# Altium project Placa_registros.PrjPcb (part 2 of 2)

## Sheet LED´s_Teclado2.SchDoc
size A4
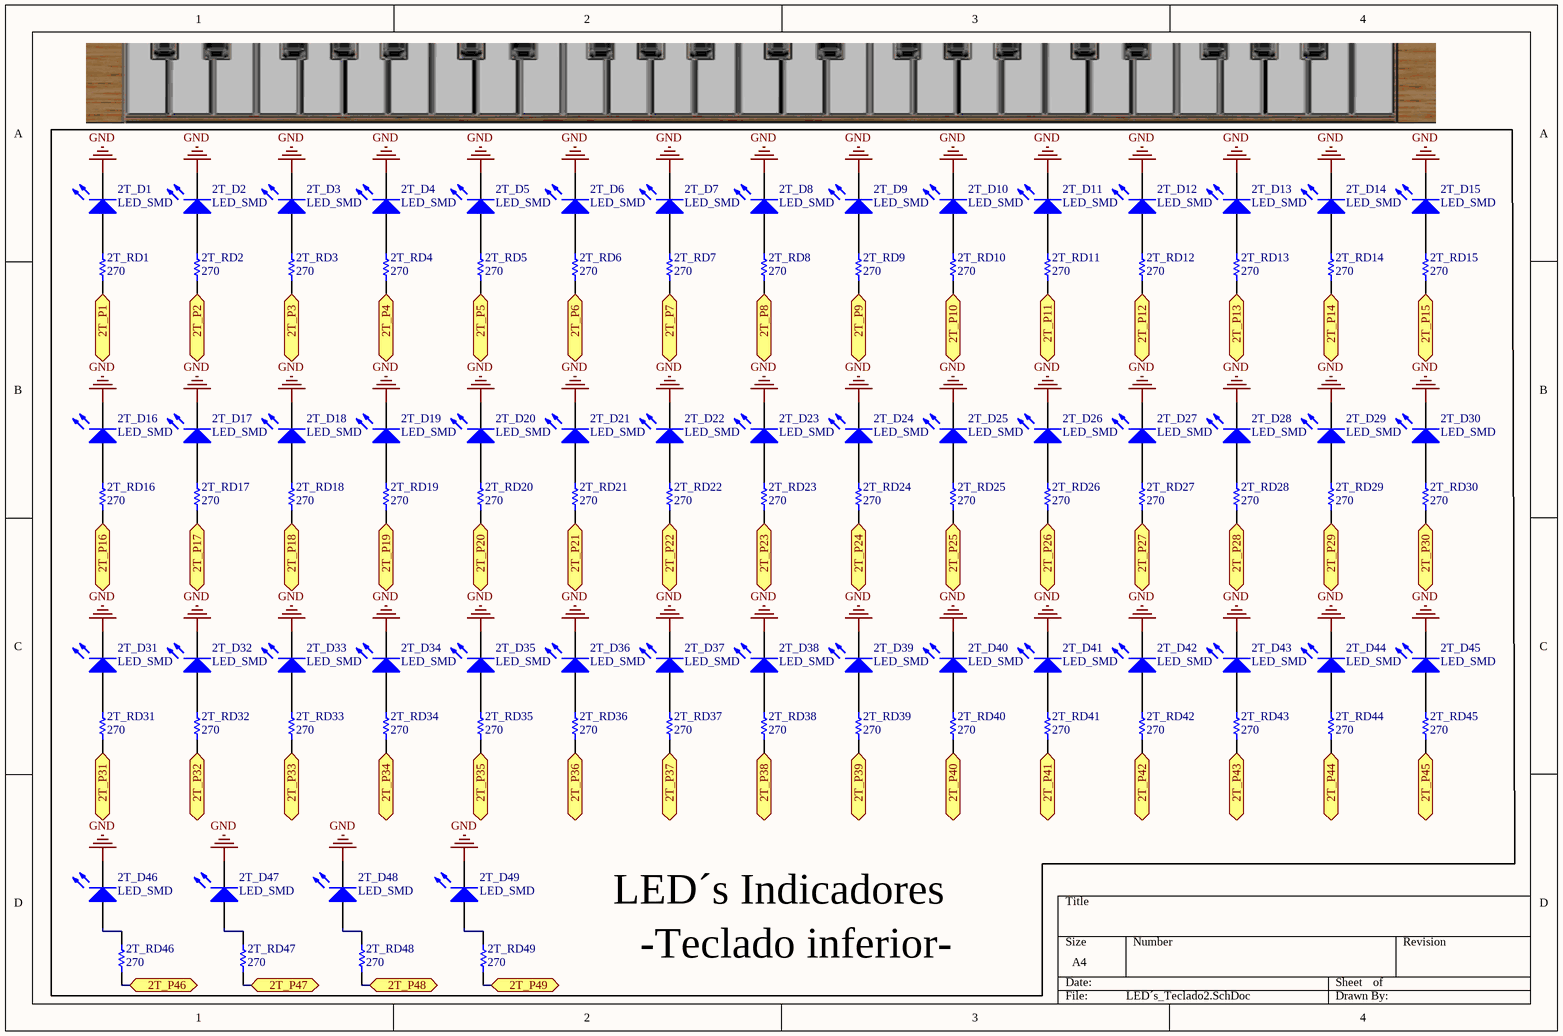
[diagram p7: LED´s_Teclado2.SchDoc]

### Parts
2T_D1  LED_SMD  [0805]
2T_D2  LED_SMD  [0805]
2T_D3  LED_SMD  [0805]
2T_D4  LED_SMD  [0805]
2T_D5  LED_SMD  [0805]
2T_D6  LED_SMD  [0805]
2T_D7  LED_SMD  [0805]
2T_D8  LED_SMD  [0805]
2T_D9  LED_SMD  [0805]
2T_D10  LED_SMD  [0805]
2T_D11  LED_SMD  [0805]
2T_D12  LED_SMD  [0805]
2T_D13  LED_SMD  [0805]
2T_D14  LED_SMD  [0805]
2T_D15  LED_SMD  [0805]
2T_D16  LED_SMD  [0805]
2T_D17  LED_SMD  [0805]
2T_D18  LED_SMD  [0805]
2T_D19  LED_SMD  [0805]
2T_D20  LED_SMD  [0805]
2T_D21  LED_SMD  [0805]
2T_D22  LED_SMD  [0805]
2T_D23  LED_SMD  [0805]
2T_D24  LED_SMD  [0805]
2T_D25  LED_SMD  [0805]
2T_D26  LED_SMD  [0805]
2T_D27  LED_SMD  [0805]
2T_D28  LED_SMD  [0805]
2T_D29  LED_SMD  [0805]
2T_D30  LED_SMD  [0805]
2T_D31  LED_SMD  [0805]
2T_D32  LED_SMD  [0805]
2T_D33  LED_SMD  [0805]
2T_D34  LED_SMD  [0805]
2T_D35  LED_SMD  [0805]
2T_D36  LED_SMD  [0805]
2T_D37  LED_SMD  [0805]
2T_D38  LED_SMD  [0805]
2T_D39  LED_SMD  [0805]
2T_D40  LED_SMD  [0805]
2T_D41  LED_SMD  [0805]
2T_D42  LED_SMD  [0805]
2T_D43  LED_SMD  [0805]
2T_D44  LED_SMD  [0805]
2T_D45  LED_SMD  [0805]
2T_D46  LED_SMD  [0805]
2T_D47  LED_SMD  [0805]
2T_D48  LED_SMD  [0805]
2T_D49  LED_SMD  [0805]
2T_RD1  value 270  [0805 Chip Res]  (hidden comment: Res Chip 0805)
2T_RD2  value 270  [0805 Chip Res]  (hidden comment: Res Chip 0805)
2T_RD3  value 270  [0805 Chip Res]  (hidden comment: Res Chip 0805)
2T_RD4  value 270  [0805 Chip Res]  (hidden comment: Res Chip 0805)
2T_RD5  value 270  [0805 Chip Res]  (hidden comment: Res Chip 0805)
2T_RD6  value 270  [0805 Chip Res]  (hidden comment: Res Chip 0805)
2T_RD7  value 270  [0805 Chip Res]  (hidden comment: Res Chip 0805)
2T_RD8  value 270  [0805 Chip Res]  (hidden comment: Res Chip 0805)
2T_RD9  value 270  [0805 Chip Res]  (hidden comment: Res Chip 0805)
2T_RD10  value 270  [0805 Chip Res]  (hidden comment: Res Chip 0805)
2T_RD11  value 270  [0805 Chip Res]  (hidden comment: Res Chip 0805)
2T_RD12  value 270  [0805 Chip Res]  (hidden comment: Res Chip 0805)
2T_RD13  value 270  [0805 Chip Res]  (hidden comment: Res Chip 0805)
2T_RD14  value 270  [0805 Chip Res]  (hidden comment: Res Chip 0805)
2T_RD15  value 270  [0805 Chip Res]  (hidden comment: Res Chip 0805)
2T_RD16  value 270  [0805 Chip Res]  (hidden comment: Res Chip 0805)
2T_RD17  value 270  [0805 Chip Res]  (hidden comment: Res Chip 0805)
2T_RD18  value 270  [0805 Chip Res]  (hidden comment: Res Chip 0805)
2T_RD19  value 270  [0805 Chip Res]  (hidden comment: Res Chip 0805)
2T_RD20  value 270  [0805 Chip Res]  (hidden comment: Res Chip 0805)
2T_RD21  value 270  [0805 Chip Res]  (hidden comment: Res Chip 0805)
2T_RD22  value 270  [0805 Chip Res]  (hidden comment: Res Chip 0805)
2T_RD23  value 270  [0805 Chip Res]  (hidden comment: Res Chip 0805)
2T_RD24  value 270  [0805 Chip Res]  (hidden comment: Res Chip 0805)
2T_RD25  value 270  [0805 Chip Res]  (hidden comment: Res Chip 0805)
2T_RD26  value 270  [0805 Chip Res]  (hidden comment: Res Chip 0805)
2T_RD27  value 270  [0805 Chip Res]  (hidden comment: Res Chip 0805)
2T_RD28  value 270  [0805 Chip Res]  (hidden comment: Res Chip 0805)
2T_RD29  value 270  [0805 Chip Res]  (hidden comment: Res Chip 0805)
2T_RD30  value 270  [0805 Chip Res]  (hidden comment: Res Chip 0805)
2T_RD31  value 270  [0805 Chip Res]  (hidden comment: Res Chip 0805)
2T_RD32  value 270  [0805 Chip Res]  (hidden comment: Res Chip 0805)
2T_RD33  value 270  [0805 Chip Res]  (hidden comment: Res Chip 0805)
2T_RD34  value 270  [0805 Chip Res]  (hidden comment: Res Chip 0805)
2T_RD35  value 270  [0805 Chip Res]  (hidden comment: Res Chip 0805)
2T_RD36  value 270  [0805 Chip Res]  (hidden comment: Res Chip 0805)
2T_RD37  value 270  [0805 Chip Res]  (hidden comment: Res Chip 0805)
2T_RD38  value 270  [0805 Chip Res]  (hidden comment: Res Chip 0805)
2T_RD39  value 270  [0805 Chip Res]  (hidden comment: Res Chip 0805)
2T_RD40  value 270  [0805 Chip Res]  (hidden comment: Res Chip 0805)
2T_RD41  value 270  [0805 Chip Res]  (hidden comment: Res Chip 0805)
2T_RD42  value 270  [0805 Chip Res]  (hidden comment: Res Chip 0805)
2T_RD43  value 270  [0805 Chip Res]  (hidden comment: Res Chip 0805)
2T_RD44  value 270  [0805 Chip Res]  (hidden comment: Res Chip 0805)
2T_RD45  value 270  [0805 Chip Res]  (hidden comment: Res Chip 0805)
2T_RD46  value 270  [0805 Chip Res]  (hidden comment: Res Chip 0805)
2T_RD47  value 270  [0805 Chip Res]  (hidden comment: Res Chip 0805)
2T_RD48  value 270  [0805 Chip Res]  (hidden comment: Res Chip 0805)
2T_RD49  value 270  [0805 Chip Res]  (hidden comment: Res Chip 0805)

### Ports
2T_P1, 2T_P2, 2T_P3, 2T_P4, 2T_P5, 2T_P6, 2T_P7, 2T_P8, 2T_P9, 2T_P10, 2T_P11, 2T_P12, 2T_P13, 2T_P14, 2T_P15, 2T_P16, 2T_P17, 2T_P18, 2T_P19, 2T_P20, 2T_P21, 2T_P22, 2T_P23, 2T_P24, 2T_P25, 2T_P26, 2T_P27, 2T_P28, 2T_P29, 2T_P30, 2T_P31, 2T_P32, 2T_P33, 2T_P34, 2T_P35, 2T_P36, 2T_P37, 2T_P38, 2T_P39, 2T_P40, 2T_P41, 2T_P42, 2T_P43, 2T_P44, 2T_P45, 2T_P46, 2T_P47, 2T_P48, 2T_P49

### Nets
GND: 2T_D1.2(K) 2T_D2.2(K) 2T_D3.2(K) 2T_D4.2(K) 2T_D5.2(K) 2T_D6.2(K) 2T_D7.2(K) 2T_D8.2(K) 2T_D9.2(K) 2T_D10.2(K) 2T_D11.2(K) 2T_D12.2(K) 2T_D13.2(K) 2T_D14.2(K) 2T_D15.2(K) 2T_D16.2(K) 2T_D17.2(K) 2T_D18.2(K) 2T_D19.2(K) 2T_D20.2(K) 2T_D21.2(K) 2T_D22.2(K) 2T_D23.2(K) 2T_D24.2(K) 2T_D25.2(K) 2T_D26.2(K) 2T_D27.2(K) 2T_D28.2(K) 2T_D29.2(K) 2T_D30.2(K) 2T_D31.2(K) 2T_D32.2(K) 2T_D33.2(K) 2T_D34.2(K) 2T_D35.2(K) 2T_D36.2(K) 2T_D37.2(K) 2T_D38.2(K) 2T_D39.2(K) 2T_D40.2(K) 2T_D41.2(K) 2T_D42.2(K) 2T_D43.2(K) 2T_D44.2(K) 2T_D45.2(K) 2T_D46.2(K) 2T_D47.2(K) 2T_D48.2(K) 2T_D49.2(K)
Net2T_A1_10: 2T_RD7.1 ; port 2T_P7
Net2T_A1_11: 2T_RD6.1 ; port 2T_P6
Net2T_A1_12: 2T_RD5.1 ; port 2T_P5
Net2T_A1_13: 2T_RD4.1 ; port 2T_P4
Net2T_A1_14: 2T_RD3.1 ; port 2T_P3
Net2T_A1_15: 2T_RD2.1 ; port 2T_P2
Net2T_A1_16: 2T_RD1.1 ; port 2T_P1
Net2T_A2_10: 2T_RD14.1 ; port 2T_P14
Net2T_A2_11: 2T_RD13.1 ; port 2T_P13
Net2T_A2_12: 2T_RD12.1 ; port 2T_P12
Net2T_A2_13: 2T_RD11.1 ; port 2T_P11
Net2T_A2_14: 2T_RD10.1 ; port 2T_P10
Net2T_A2_15: 2T_RD9.1 ; port 2T_P9
Net2T_A2_16: 2T_RD8.1 ; port 2T_P8
Net2T_A3_10: 2T_RD21.1 ; port 2T_P21
Net2T_A3_11: 2T_RD20.1 ; port 2T_P20
Net2T_A3_12: 2T_RD19.1 ; port 2T_P19
Net2T_A3_13: 2T_RD18.1 ; port 2T_P18
Net2T_A3_14: 2T_RD17.1 ; port 2T_P17
Net2T_A3_15: 2T_RD16.1 ; port 2T_P16
Net2T_A3_16: 2T_RD15.1 ; port 2T_P15
Net2T_A4_10: 2T_RD28.1 ; port 2T_P28
Net2T_A4_11: 2T_RD27.1 ; port 2T_P27
Net2T_A4_12: 2T_RD26.1 ; port 2T_P26
Net2T_A4_13: 2T_RD25.1 ; port 2T_P25
Net2T_A4_14: 2T_RD24.1 ; port 2T_P24
Net2T_A4_15: 2T_RD23.1 ; port 2T_P23
Net2T_A4_16: 2T_RD22.1 ; port 2T_P22
Net2T_A5_10: 2T_RD35.1 ; port 2T_P35
Net2T_A5_11: 2T_RD34.1 ; port 2T_P34
Net2T_A5_12: 2T_RD33.1 ; port 2T_P33
Net2T_A5_13: 2T_RD32.1 ; port 2T_P32
Net2T_A5_14: 2T_RD31.1 ; port 2T_P31
Net2T_A5_15: 2T_RD30.1 ; port 2T_P30
Net2T_A5_16: 2T_RD29.1 ; port 2T_P29
Net2T_A6_10: 2T_RD42.1 ; port 2T_P42
Net2T_A6_11: 2T_RD41.1 ; port 2T_P41
Net2T_A6_12: 2T_RD40.1 ; port 2T_P40
Net2T_A6_13: 2T_RD39.1 ; port 2T_P39
Net2T_A6_14: 2T_RD38.1 ; port 2T_P38
Net2T_A6_15: 2T_RD37.1 ; port 2T_P37
Net2T_A6_16: 2T_RD36.1 ; port 2T_P36
Net2T_A7_10: 2T_RD49.1 ; port 2T_P49
Net2T_A7_11: 2T_RD48.1 ; port 2T_P48
Net2T_A7_12: 2T_RD47.1 ; port 2T_P47
Net2T_A7_13: 2T_RD46.1 ; port 2T_P46
Net2T_A7_14: 2T_RD45.1 ; port 2T_P45
Net2T_A7_15: 2T_RD44.1 ; port 2T_P44
Net2T_A7_16: 2T_RD43.1 ; port 2T_P43
Net2T_D1_1: 2T_D1.1(A) 2T_RD1.2
Net2T_D2_1: 2T_D2.1(A) 2T_RD2.2
Net2T_D3_1: 2T_D3.1(A) 2T_RD3.2
Net2T_D4_1: 2T_D4.1(A) 2T_RD4.2
Net2T_D5_1: 2T_D5.1(A) 2T_RD5.2
Net2T_D6_1: 2T_D6.1(A) 2T_RD6.2
Net2T_D7_1: 2T_D7.1(A) 2T_RD7.2
Net2T_D8_1: 2T_D8.1(A) 2T_RD8.2
Net2T_D9_1: 2T_D9.1(A) 2T_RD9.2
Net2T_D10_1: 2T_D10.1(A) 2T_RD10.2
Net2T_D11_1: 2T_D11.1(A) 2T_RD11.2
Net2T_D12_1: 2T_D12.1(A) 2T_RD12.2
Net2T_D13_1: 2T_D13.1(A) 2T_RD13.2
Net2T_D14_1: 2T_D14.1(A) 2T_RD14.2
Net2T_D15_1: 2T_D15.1(A) 2T_RD15.2
Net2T_D16_1: 2T_D16.1(A) 2T_RD16.2
Net2T_D17_1: 2T_D17.1(A) 2T_RD17.2
Net2T_D18_1: 2T_D18.1(A) 2T_RD18.2
Net2T_D19_1: 2T_D19.1(A) 2T_RD19.2
Net2T_D20_1: 2T_D20.1(A) 2T_RD20.2
Net2T_D21_1: 2T_D21.1(A) 2T_RD21.2
Net2T_D22_1: 2T_D22.1(A) 2T_RD22.2
Net2T_D23_1: 2T_D23.1(A) 2T_RD23.2
Net2T_D24_1: 2T_D24.1(A) 2T_RD24.2
Net2T_D25_1: 2T_D25.1(A) 2T_RD25.2
Net2T_D26_1: 2T_D26.1(A) 2T_RD26.2
Net2T_D27_1: 2T_D27.1(A) 2T_RD27.2
Net2T_D28_1: 2T_D28.1(A) 2T_RD28.2
Net2T_D29_1: 2T_D29.1(A) 2T_RD29.2
Net2T_D30_1: 2T_D30.1(A) 2T_RD30.2
Net2T_D31_1: 2T_D31.1(A) 2T_RD31.2
Net2T_D32_1: 2T_D32.1(A) 2T_RD32.2
Net2T_D33_1: 2T_D33.1(A) 2T_RD33.2
Net2T_D34_1: 2T_D34.1(A) 2T_RD34.2
Net2T_D35_1: 2T_D35.1(A) 2T_RD35.2
Net2T_D36_1: 2T_D36.1(A) 2T_RD36.2
Net2T_D37_1: 2T_D37.1(A) 2T_RD37.2
Net2T_D38_1: 2T_D38.1(A) 2T_RD38.2
Net2T_D39_1: 2T_D39.1(A) 2T_RD39.2
Net2T_D40_1: 2T_D40.1(A) 2T_RD40.2
Net2T_D41_1: 2T_D41.1(A) 2T_RD41.2
Net2T_D42_1: 2T_D42.1(A) 2T_RD42.2
Net2T_D43_1: 2T_D43.1(A) 2T_RD43.2
Net2T_D44_1: 2T_D44.1(A) 2T_RD44.2
Net2T_D45_1: 2T_D45.1(A) 2T_RD45.2
Net2T_D46_1: 2T_D46.1(A) 2T_RD46.2
Net2T_D47_1: 2T_D47.1(A) 2T_RD47.2
Net2T_D48_1: 2T_D48.1(A) 2T_RD48.2
Net2T_D49_1: 2T_D49.1(A) 2T_RD49.2

### Notes on the sheet
- LED´s Indicadores
- -Teclado inferior-

### Library data of the parts
2T_D1-2T_D49 = LED_SMD: LED SMD; Published: 8-Jun-2000; LatestRevisionDate: 08-Jul-2005; LatestRevisionNote: Mech Layer 1 removed.; PackageReference: LED-0; Publisher: Altium Limited
2T_RD1-2T_RD49 = Resistencia: Published: 8-Jun-2000; LatestRevisionDate: 17-Jul-2002; LatestRevisionNote: Re-released for DXP Platform.; PackageReference: AXIAL-0.3; Publisher: Altium Limited; PackageDescription: Axial Device, Thru-Hole; 2 Leads; 0.3 in Pin Spacing

## Sheet LED´s_Valvulas.SchDoc
size A4
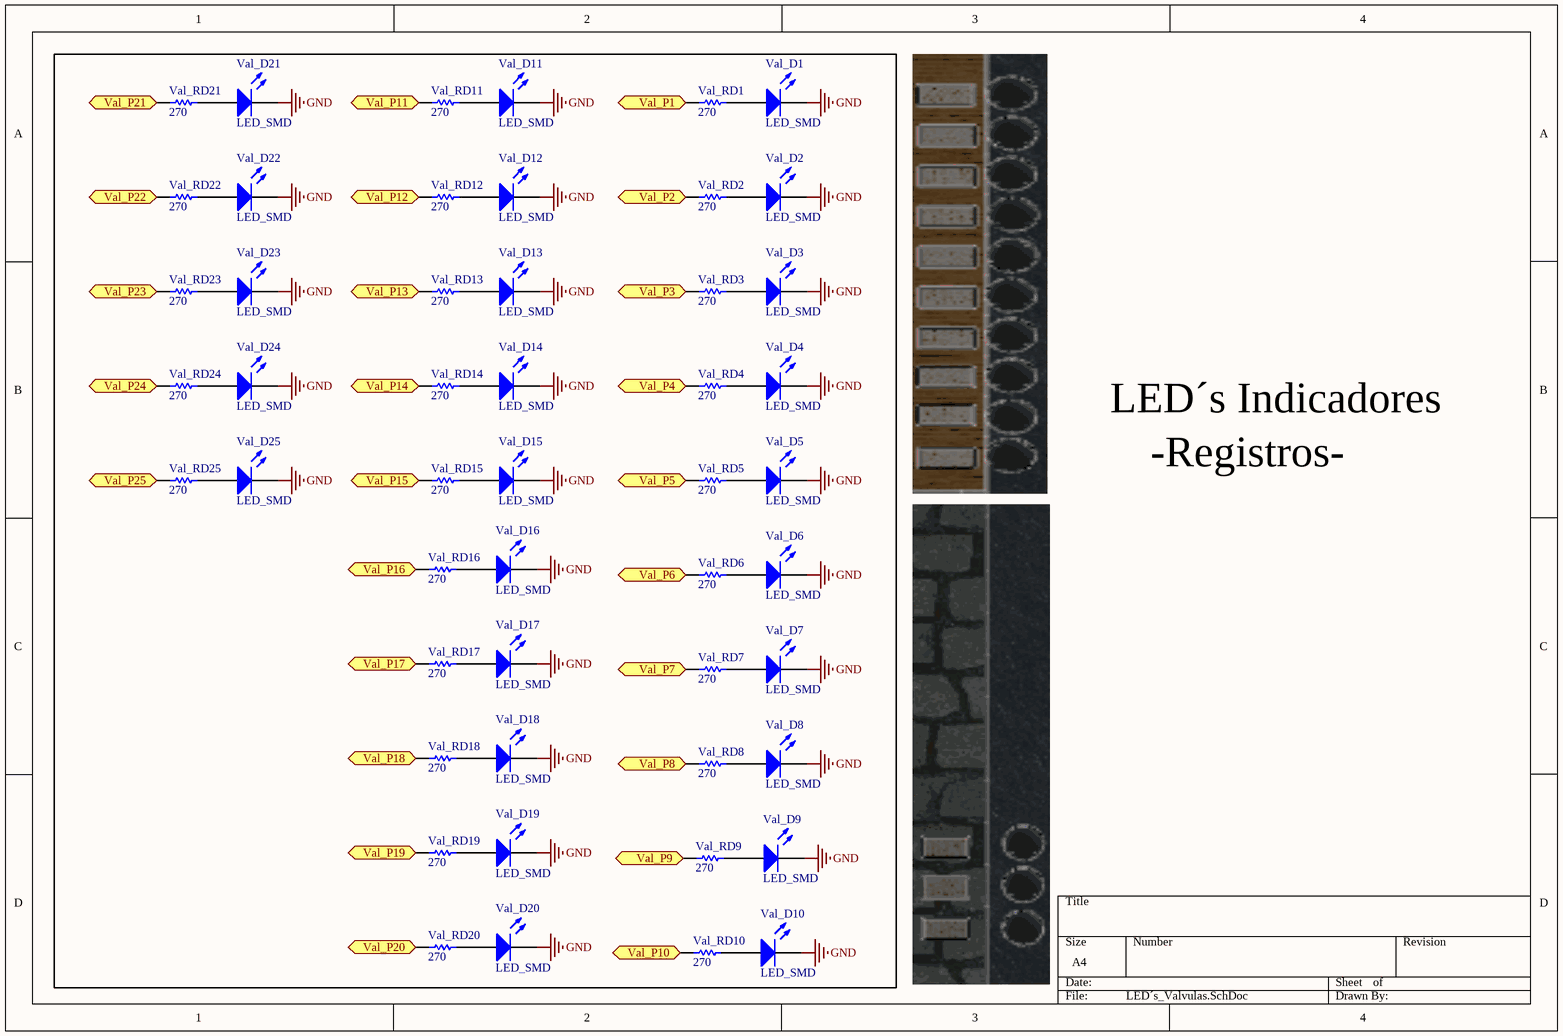
[diagram p8: LED´s_Valvulas.SchDoc]

### Parts
Val_D1  LED_SMD  [0805]
Val_D2  LED_SMD  [0805]
Val_D3  LED_SMD  [0805]
Val_D4  LED_SMD  [0805]
Val_D5  LED_SMD  [0805]
Val_D6  LED_SMD  [0805]
Val_D7  LED_SMD  [0805]
Val_D8  LED_SMD  [0805]
Val_D9  LED_SMD  [0805]
Val_D10  LED_SMD  [0805]
Val_D11  LED_SMD  [0805]
Val_D12  LED_SMD  [0805]
Val_D13  LED_SMD  [0805]
Val_D14  LED_SMD  [0805]
Val_D15  LED_SMD  [0805]
Val_D16  LED_SMD  [0805]
Val_D17  LED_SMD  [0805]
Val_D18  LED_SMD  [0805]
Val_D19  LED_SMD  [0805]
Val_D20  LED_SMD  [0805]
Val_D21  LED_SMD  [0805]
Val_D22  LED_SMD  [0805]
Val_D23  LED_SMD  [0805]
Val_D24  LED_SMD  [0805]
Val_D25  LED_SMD  [0805]
Val_RD1  value 270  [0805 Chip Res]  (hidden comment: Res Chip 0805)
Val_RD2  value 270  [0805 Chip Res]  (hidden comment: Res Chip 0805)
Val_RD3  value 270  [0805 Chip Res]  (hidden comment: Res Chip 0805)
Val_RD4  value 270  [0805 Chip Res]  (hidden comment: Res Chip 0805)
Val_RD5  value 270  [0805 Chip Res]  (hidden comment: Res Chip 0805)
Val_RD6  value 270  [0805 Chip Res]  (hidden comment: Res Chip 0805)
Val_RD7  value 270  [0805 Chip Res]  (hidden comment: Res Chip 0805)
Val_RD8  value 270  [0805 Chip Res]  (hidden comment: Res Chip 0805)
Val_RD9  value 270  [0805 Chip Res]  (hidden comment: Res Chip 0805)
Val_RD10  value 270  [0805 Chip Res]  (hidden comment: Res Chip 0805)
Val_RD11  value 270  [0805 Chip Res]  (hidden comment: Res Chip 0805)
Val_RD12  value 270  [0805 Chip Res]  (hidden comment: Res Chip 0805)
Val_RD13  value 270  [0805 Chip Res]  (hidden comment: Res Chip 0805)
Val_RD14  value 270  [0805 Chip Res]  (hidden comment: Res Chip 0805)
Val_RD15  value 270  [0805 Chip Res]  (hidden comment: Res Chip 0805)
Val_RD16  value 270  [0805 Chip Res]  (hidden comment: Res Chip 0805)
Val_RD17  value 270  [0805 Chip Res]  (hidden comment: Res Chip 0805)
Val_RD18  value 270  [0805 Chip Res]  (hidden comment: Res Chip 0805)
Val_RD19  value 270  [0805 Chip Res]  (hidden comment: Res Chip 0805)
Val_RD20  value 270  [0805 Chip Res]  (hidden comment: Res Chip 0805)
Val_RD21  value 270  [0805 Chip Res]  (hidden comment: Res Chip 0805)
Val_RD22  value 270  [0805 Chip Res]  (hidden comment: Res Chip 0805)
Val_RD23  value 270  [0805 Chip Res]  (hidden comment: Res Chip 0805)
Val_RD24  value 270  [0805 Chip Res]  (hidden comment: Res Chip 0805)
Val_RD25  value 270  [0805 Chip Res]  (hidden comment: Res Chip 0805)

### Ports
Val_P1, Val_P2, Val_P3, Val_P4, Val_P5, Val_P6, Val_P7, Val_P8, Val_P9, Val_P10, Val_P11, Val_P12, Val_P13, Val_P14, Val_P15, Val_P16, Val_P17, Val_P18, Val_P19, Val_P20, Val_P21, Val_P22, Val_P23, Val_P24, Val_P25

### Nets
GND: Val_D1.2(K) Val_D2.2(K) Val_D3.2(K) Val_D4.2(K) Val_D5.2(K) Val_D6.2(K) Val_D7.2(K) Val_D8.2(K) Val_D9.2(K) Val_D10.2(K) Val_D11.2(K) Val_D12.2(K) Val_D13.2(K) Val_D14.2(K) Val_D15.2(K) Val_D16.2(K) Val_D17.2(K) Val_D18.2(K) Val_D19.2(K) Val_D20.2(K) Val_D21.2(K) Val_D22.2(K) Val_D23.2(K) Val_D24.2(K) Val_D25.2(K)
NetPines_Valvulas_1: Val_RD1.1 ; port Val_P1
NetPines_Valvulas_2: Val_RD14.1 ; port Val_P14
NetPines_Valvulas_3: Val_RD2.1 ; port Val_P2
NetPines_Valvulas_4: Val_RD15.1 ; port Val_P15
NetPines_Valvulas_5: Val_RD3.1 ; port Val_P3
NetPines_Valvulas_6: Val_RD16.1 ; port Val_P16
NetPines_Valvulas_7: Val_RD4.1 ; port Val_P4
NetPines_Valvulas_8: Val_RD17.1 ; port Val_P17
NetPines_Valvulas_9: Val_RD5.1 ; port Val_P5
NetPines_Valvulas_10: Val_RD18.1 ; port Val_P18
NetPines_Valvulas_11: Val_RD6.1 ; port Val_P6
NetPines_Valvulas_12: Val_RD19.1 ; port Val_P19
NetPines_Valvulas_13: Val_RD7.1 ; port Val_P7
NetPines_Valvulas_14: Val_RD20.1 ; port Val_P20
NetPines_Valvulas_15: Val_RD8.1 ; port Val_P8
NetPines_Valvulas_16: Val_RD21.1 ; port Val_P21
NetPines_Valvulas_17: Val_RD9.1 ; port Val_P9
NetPines_Valvulas_18: Val_RD22.1 ; port Val_P22
NetPines_Valvulas_19: Val_RD10.1 ; port Val_P10
NetPines_Valvulas_20: Val_RD23.1 ; port Val_P23
NetPines_Valvulas_21: Val_RD11.1 ; port Val_P11
NetPines_Valvulas_22: Val_RD24.1 ; port Val_P24
NetPines_Valvulas_23: Val_RD12.1 ; port Val_P12
NetPines_Valvulas_24: Val_RD25.1 ; port Val_P25
NetPines_Valvulas_25: Val_RD13.1 ; port Val_P13
NetVal_D1_1: Val_D1.1(A) Val_RD1.2
NetVal_D2_1: Val_D2.1(A) Val_RD2.2
NetVal_D3_1: Val_D3.1(A) Val_RD3.2
NetVal_D4_1: Val_D4.1(A) Val_RD4.2
NetVal_D5_1: Val_D5.1(A) Val_RD5.2
NetVal_D6_1: Val_D6.1(A) Val_RD6.2
NetVal_D7_1: Val_D7.1(A) Val_RD7.2
NetVal_D8_1: Val_D8.1(A) Val_RD8.2
NetVal_D9_1: Val_D9.1(A) Val_RD9.2
NetVal_D10_1: Val_D10.1(A) Val_RD10.2
NetVal_D11_1: Val_D11.1(A) Val_RD11.2
NetVal_D12_1: Val_D12.1(A) Val_RD12.2
NetVal_D13_1: Val_D13.1(A) Val_RD13.2
NetVal_D14_1: Val_D14.1(A) Val_RD14.2
NetVal_D15_1: Val_D15.1(A) Val_RD15.2
NetVal_D16_1: Val_D16.1(A) Val_RD16.2
NetVal_D17_1: Val_D17.1(A) Val_RD17.2
NetVal_D18_1: Val_D18.1(A) Val_RD18.2
NetVal_D19_1: Val_D19.1(A) Val_RD19.2
NetVal_D20_1: Val_D20.1(A) Val_RD20.2
NetVal_D21_1: Val_D21.1(A) Val_RD21.2
NetVal_D22_1: Val_D22.1(A) Val_RD22.2
NetVal_D23_1: Val_D23.1(A) Val_RD23.2
NetVal_D24_1: Val_D24.1(A) Val_RD24.2
NetVal_D25_1: Val_D25.1(A) Val_RD25.2

### Notes on the sheet
- LED´s Indicadores
- -Registros-

### Library data of the parts
Val_D1-Val_D25 = LED_SMD: LED SMD; Published: 8-Jun-2000; LatestRevisionDate: 08-Jul-2005; LatestRevisionNote: Mech Layer 1 removed.; PackageReference: LED-0; Publisher: Altium Limited
Val_RD1-Val_RD25 = Resistencia: Published: 8-Jun-2000; LatestRevisionDate: 17-Jul-2002; LatestRevisionNote: Re-released for DXP Platform.; PackageReference: AXIAL-0.3; Publisher: Altium Limited; PackageDescription: Axial Device, Thru-Hole; 2 Leads; 0.3 in Pin Spacing

## Sheet LED´s_Pedal.SchDoc
size A4
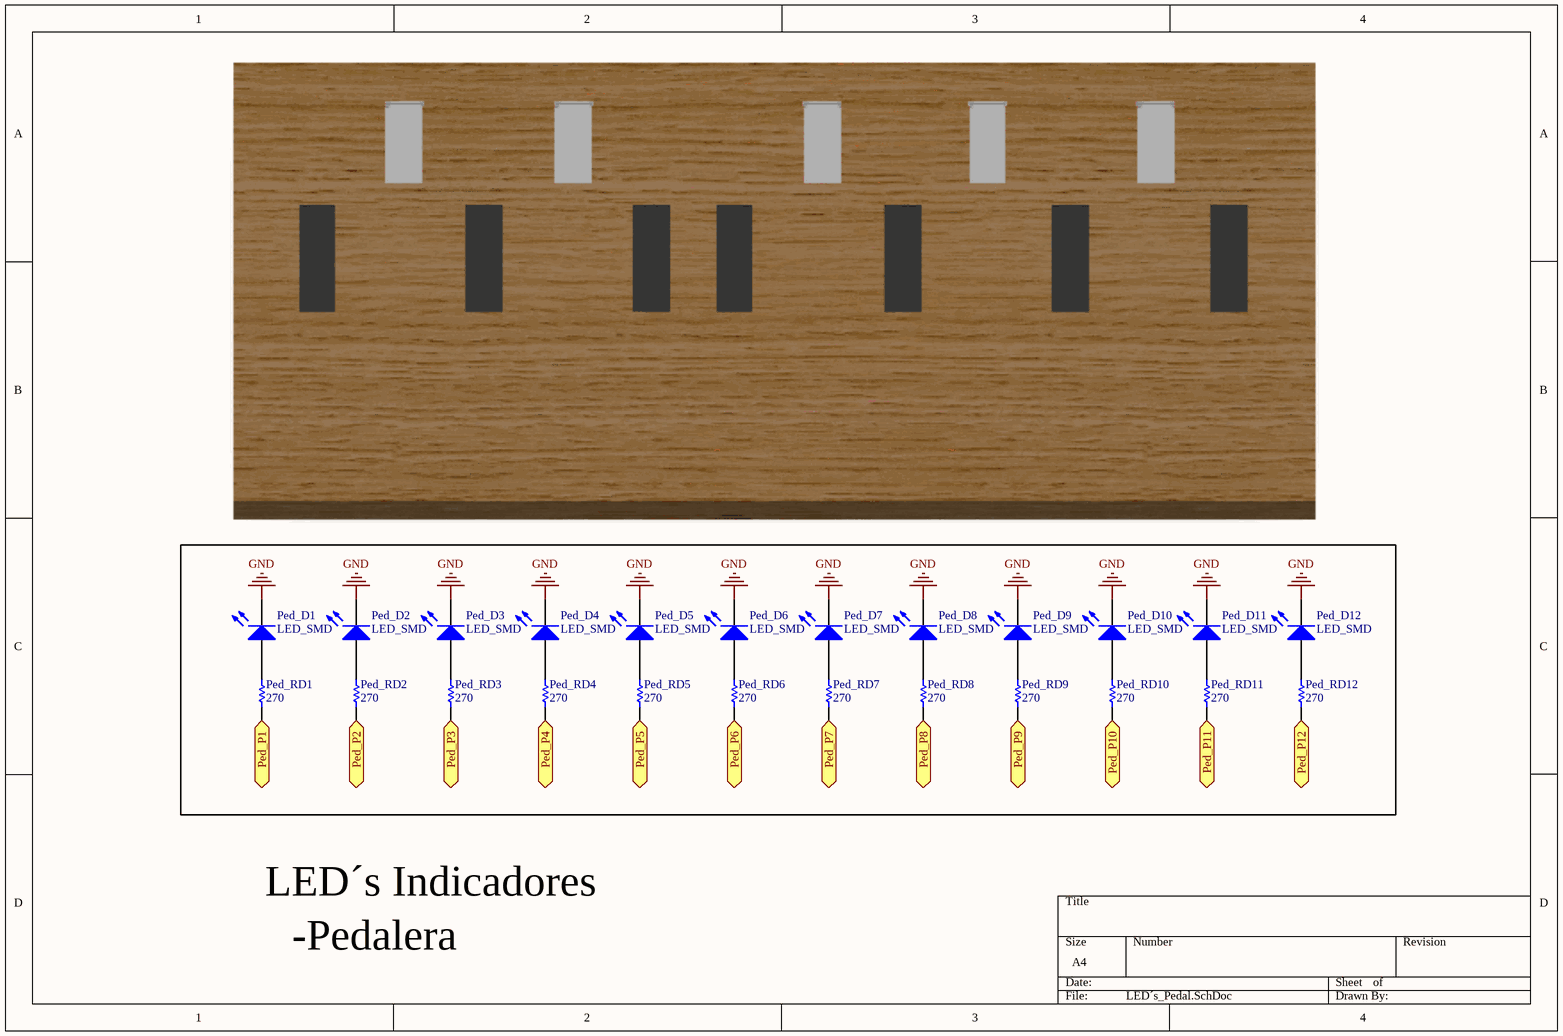
[diagram p9: LED´s_Pedal.SchDoc]

### Parts
Ped_D1  LED_SMD  [0805]
Ped_D2  LED_SMD  [0805]
Ped_D3  LED_SMD  [0805]
Ped_D4  LED_SMD  [0805]
Ped_D5  LED_SMD  [0805]
Ped_D6  LED_SMD  [0805]
Ped_D7  LED_SMD  [0805]
Ped_D8  LED_SMD  [0805]
Ped_D9  LED_SMD  [0805]
Ped_D10  LED_SMD  [0805]
Ped_D11  LED_SMD  [0805]
Ped_D12  LED_SMD  [0805]
Ped_RD1  value 270  [0805 Chip Res]  (hidden comment: Res Chip 0805)
Ped_RD2  value 270  [0805 Chip Res]  (hidden comment: Res Chip 0805)
Ped_RD3  value 270  [0805 Chip Res]  (hidden comment: Res Chip 0805)
Ped_RD4  value 270  [0805 Chip Res]  (hidden comment: Res Chip 0805)
Ped_RD5  value 270  [0805 Chip Res]  (hidden comment: Res Chip 0805)
Ped_RD6  value 270  [0805 Chip Res]  (hidden comment: Res Chip 0805)
Ped_RD7  value 270  [0805 Chip Res]  (hidden comment: Res Chip 0805)
Ped_RD8  value 270  [0805 Chip Res]  (hidden comment: Res Chip 0805)
Ped_RD9  value 270  [0805 Chip Res]  (hidden comment: Res Chip 0805)
Ped_RD10  value 270  [0805 Chip Res]  (hidden comment: Res Chip 0805)
Ped_RD11  value 270  [0805 Chip Res]  (hidden comment: Res Chip 0805)
Ped_RD12  value 270  [0805 Chip Res]  (hidden comment: Res Chip 0805)

### Ports
Ped_P1, Ped_P2, Ped_P3, Ped_P4, Ped_P5, Ped_P6, Ped_P7, Ped_P8, Ped_P9, Ped_P10, Ped_P11, Ped_P12

### Nets
GND: Ped_D1.2(K) Ped_D2.2(K) Ped_D3.2(K) Ped_D4.2(K) Ped_D5.2(K) Ped_D6.2(K) Ped_D7.2(K) Ped_D8.2(K) Ped_D9.2(K) Ped_D10.2(K) Ped_D11.2(K) Ped_D12.2(K)
NetPed_A1_10: Ped_RD7.1 ; port Ped_P7
NetPed_A1_11: Ped_RD6.1 ; port Ped_P6
NetPed_A1_12: Ped_RD5.1 ; port Ped_P5
NetPed_A1_13: Ped_RD4.1 ; port Ped_P4
NetPed_A1_14: Ped_RD3.1 ; port Ped_P3
NetPed_A1_15: Ped_RD2.1 ; port Ped_P2
NetPed_A1_16: Ped_RD1.1 ; port Ped_P1
NetPed_A2_12: Ped_RD12.1 ; port Ped_P12
NetPed_A2_13: Ped_RD11.1 ; port Ped_P11
NetPed_A2_14: Ped_RD10.1 ; port Ped_P10
NetPed_A2_15: Ped_RD9.1 ; port Ped_P9
NetPed_A2_16: Ped_RD8.1 ; port Ped_P8
NetPed_D1_1: Ped_D1.1(A) Ped_RD1.2
NetPed_D2_1: Ped_D2.1(A) Ped_RD2.2
NetPed_D3_1: Ped_D3.1(A) Ped_RD3.2
NetPed_D4_1: Ped_D4.1(A) Ped_RD4.2
NetPed_D5_1: Ped_D5.1(A) Ped_RD5.2
NetPed_D6_1: Ped_D6.1(A) Ped_RD6.2
NetPed_D7_1: Ped_D7.1(A) Ped_RD7.2
NetPed_D8_1: Ped_D8.1(A) Ped_RD8.2
NetPed_D9_1: Ped_D9.1(A) Ped_RD9.2
NetPed_D10_1: Ped_D10.1(A) Ped_RD10.2
NetPed_D11_1: Ped_D11.1(A) Ped_RD11.2
NetPed_D12_1: Ped_D12.1(A) Ped_RD12.2

### Notes on the sheet
- LED´s Indicadores
- -Pedalera

### Library data of the parts
Ped_D1-Ped_D12 = LED_SMD: LED SMD; Published: 8-Jun-2000; LatestRevisionDate: 08-Jul-2005; LatestRevisionNote: Mech Layer 1 removed.; PackageReference: LED-0; Publisher: Altium Limited
Ped_RD1-Ped_RD12 = Resistencia: Published: 8-Jun-2000; LatestRevisionDate: 17-Jul-2002; LatestRevisionNote: Re-released for DXP Platform.; PackageReference: AXIAL-0.3; Publisher: Altium Limited; PackageDescription: Axial Device, Thru-Hole; 2 Leads; 0.3 in Pin Spacing

## Nets that join several sheets
GND: 1Teclado (21 pins), 2Teclado (21 pins), Valvulas (12 pins), Pedal (6 pins), Externos (10 pins), LED´s_1Teclado (49 pins), LED´s_Teclado2 (49 pins), LED´s_Valvulas (25 pins), LED´s_Pedal (12 pins)
VCC: 1Teclado (21 pins), 2Teclado (21 pins), Valvulas (12 pins), Pedal (6 pins), Externos (7 pins)
Net1T1_11: 1Teclado (7 pins), 2Teclado (7 pins), Valvulas (Val1.11 Val2.11 Val3.11 Val4.11), Pedal (Ped1.11 Ped2.11)
Net1T1_12: 1Teclado (7 pins), 2Teclado (7 pins), Valvulas (Val1.12 Val2.12 Val3.12 Val4.12), Pedal (Ped1.12 Ped2.12)
Net1T1_14: 1Teclado (1T1.14), GPIO_Raspberry_b+ (*.3)
Net1T7_1: 1Teclado (1T7.1), Externos (Pines_1Teclado.50)
Net1T7_2: 1Teclado (1T7.2), Externos (Pines_2Teclado.50)
Net1T7_3: 1Teclado (1T7.3), Externos (Pines_Valvulas.26)
Net1T7_4: 1Teclado (1T7.4), Externos (Pines_Sobrantes.1)
Net1T7_5: 1Teclado (1T7.5), Externos (Pines_Sobrantes.3)
Net1T7_6: 1Teclado (1T7.6), Externos (Pines_Sobrantes.5)
Net1T7_7: 1Teclado (1T7.7), Externos (Pines_Sobrantes.7)
Net1T_A1_10: 1Teclado (1T_A1.10), Externos (Pines_1Teclado.13), LED´s_1Teclado (1T_RD7.1)
Net1T_A1_11: 1Teclado (1T_A1.11), Externos (Pines_1Teclado.11), LED´s_1Teclado (1T_RD6.1)
Net1T_A1_12: 1Teclado (1T_A1.12), Externos (Pines_1Teclado.9), LED´s_1Teclado (1T_RD5.1)
Net1T_A1_13: 1Teclado (1T_A1.13), Externos (Pines_1Teclado.7), LED´s_1Teclado (1T_RD4.1)
Net1T_A1_14: 1Teclado (1T_A1.14), Externos (Pines_1Teclado.5), LED´s_1Teclado (1T_RD3.1)
Net1T_A1_15: 1Teclado (1T_A1.15), Externos (Pines_1Teclado.3), LED´s_1Teclado (1T_RD2.1)
Net1T_A1_16: 1Teclado (1T_A1.16), Externos (Pines_1Teclado.1), LED´s_1Teclado (1T_RD1.1)
Net1T_A2_10: 1Teclado (1T_A2.10), Externos (Pines_1Teclado.27), LED´s_1Teclado (1T_RD14.1)
Net1T_A2_11: 1Teclado (1T_A2.11), Externos (Pines_1Teclado.25), LED´s_1Teclado (1T_RD13.1)
Net1T_A2_12: 1Teclado (1T_A2.12), Externos (Pines_1Teclado.23), LED´s_1Teclado (1T_RD12.1)
Net1T_A2_13: 1Teclado (1T_A2.13), Externos (Pines_1Teclado.21), LED´s_1Teclado (1T_RD11.1)
Net1T_A2_14: 1Teclado (1T_A2.14), Externos (Pines_1Teclado.19), LED´s_1Teclado (1T_RD10.1)
Net1T_A2_15: 1Teclado (1T_A2.15), Externos (Pines_1Teclado.17), LED´s_1Teclado (1T_RD9.1)
Net1T_A2_16: 1Teclado (1T_A2.16), Externos (Pines_1Teclado.15), LED´s_1Teclado (1T_RD8.1)
Net1T_A3_10: 1Teclado (1T_A3.10), Externos (Pines_1Teclado.41), LED´s_1Teclado (1T_RD21.1)
Net1T_A3_11: 1Teclado (1T_A3.11), Externos (Pines_1Teclado.39), LED´s_1Teclado (1T_RD20.1)
Net1T_A3_12: 1Teclado (1T_A3.12), Externos (Pines_1Teclado.37), LED´s_1Teclado (1T_RD19.1)
Net1T_A3_13: 1Teclado (1T_A3.13), Externos (Pines_1Teclado.35), LED´s_1Teclado (1T_RD18.1)
Net1T_A3_14: 1Teclado (1T_A3.14), Externos (Pines_1Teclado.33), LED´s_1Teclado (1T_RD17.1)
Net1T_A3_15: 1Teclado (1T_A3.15), Externos (Pines_1Teclado.31), LED´s_1Teclado (1T_RD16.1)
Net1T_A3_16: 1Teclado (1T_A3.16), Externos (Pines_1Teclado.29), LED´s_1Teclado (1T_RD15.1)
Net1T_A4_10: 1Teclado (1T_A4.10), Externos (Pines_1Teclado.6), LED´s_1Teclado (1T_RD28.1)
Net1T_A4_11: 1Teclado (1T_A4.11), Externos (Pines_1Teclado.4), LED´s_1Teclado (1T_RD27.1)
Net1T_A4_12: 1Teclado (1T_A4.12), Externos (Pines_1Teclado.2), LED´s_1Teclado (1T_RD26.1)
Net1T_A4_13: 1Teclado (1T_A4.13), Externos (Pines_1Teclado.49), LED´s_1Teclado (1T_RD25.1)
Net1T_A4_14: 1Teclado (1T_A4.14), Externos (Pines_1Teclado.47), LED´s_1Teclado (1T_RD24.1)
Net1T_A4_15: 1Teclado (1T_A4.15), Externos (Pines_1Teclado.45), LED´s_1Teclado (1T_RD23.1)
Net1T_A4_16: 1Teclado (1T_A4.16), Externos (Pines_1Teclado.43), LED´s_1Teclado (1T_RD22.1)
Net1T_A5_10: 1Teclado (1T_A5.10), Externos (Pines_1Teclado.20), LED´s_1Teclado (1T_RD35.1)
Net1T_A5_11: 1Teclado (1T_A5.11), Externos (Pines_1Teclado.18), LED´s_1Teclado (1T_RD34.1)
Net1T_A5_12: 1Teclado (1T_A5.12), Externos (Pines_1Teclado.16), LED´s_1Teclado (1T_RD33.1)
Net1T_A5_13: 1Teclado (1T_A5.13), Externos (Pines_1Teclado.14), LED´s_1Teclado (1T_RD32.1)
Net1T_A5_14: 1Teclado (1T_A5.14), Externos (Pines_1Teclado.12), LED´s_1Teclado (1T_RD31.1)
Net1T_A5_15: 1Teclado (1T_A5.15), Externos (Pines_1Teclado.10), LED´s_1Teclado (1T_RD30.1)
Net1T_A5_16: 1Teclado (1T_A5.16), Externos (Pines_1Teclado.8), LED´s_1Teclado (1T_RD29.1)
Net1T_A6_10: 1Teclado (1T_A6.10), Externos (Pines_1Teclado.34), LED´s_1Teclado (1T_RD42.1)
Net1T_A6_11: 1Teclado (1T_A6.11), Externos (Pines_1Teclado.32), LED´s_1Teclado (1T_RD41.1)
Net1T_A6_12: 1Teclado (1T_A6.12), Externos (Pines_1Teclado.30), LED´s_1Teclado (1T_RD40.1)
Net1T_A6_13: 1Teclado (1T_A6.13), Externos (Pines_1Teclado.28), LED´s_1Teclado (1T_RD39.1)
Net1T_A6_14: 1Teclado (1T_A6.14), Externos (Pines_1Teclado.26), LED´s_1Teclado (1T_RD38.1)
Net1T_A6_15: 1Teclado (1T_A6.15), Externos (Pines_1Teclado.24), LED´s_1Teclado (1T_RD37.1)
Net1T_A6_16: 1Teclado (1T_A6.16), Externos (Pines_1Teclado.22), LED´s_1Teclado (1T_RD36.1)
Net1T_A7_10: 1Teclado (1T_A7.10), Externos (Pines_1Teclado.48), LED´s_1Teclado (1T_RD49.1)
Net1T_A7_11: 1Teclado (1T_A7.11), Externos (Pines_1Teclado.46), LED´s_1Teclado (1T_RD48.1)
Net1T_A7_12: 1Teclado (1T_A7.12), Externos (Pines_1Teclado.44), LED´s_1Teclado (1T_RD47.1)
Net1T_A7_13: 1Teclado (1T_A7.13), Externos (Pines_1Teclado.42), LED´s_1Teclado (1T_RD46.1)
Net1T_A7_14: 1Teclado (1T_A7.14), Externos (Pines_1Teclado.40), LED´s_1Teclado (1T_RD45.1)
Net1T_A7_15: 1Teclado (1T_A7.15), Externos (Pines_1Teclado.38), LED´s_1Teclado (1T_RD44.1)
Net1T_A7_16: 1Teclado (1T_A7.16), Externos (Pines_1Teclado.36), LED´s_1Teclado (1T_RD43.1)
Net2T2#1_14: 2Teclado (2T2#1.14), GPIO_Raspberry_b+ (*.5)
Net2T7_1: 2Teclado (2T7.1), Externos (Pines_Sobrantes.9)
Net2T7_2: 2Teclado (2T7.2), Externos (Pines_Sobrantes.11)
Net2T7_3: 2Teclado (2T7.3), Externos (Pines_Sobrantes.13)
Net2T7_4: 2Teclado (2T7.4), Externos (Pines_Sobrantes.15)
Net2T7_5: 2Teclado (2T7.5), Externos (Pines_Sobrantes.17)
Net2T7_6: 2Teclado (2T7.6), Externos (Pines_Sobrantes.19)
Net2T7_7: 2Teclado (2T7.7), Externos (Pines_Sobrantes.21)
Net2T_A1_10: 2Teclado (2T_A1.10), Externos (Pines_2Teclado.13), LED´s_Teclado2 (2T_RD7.1)
Net2T_A1_11: 2Teclado (2T_A1.11), Externos (Pines_2Teclado.11), LED´s_Teclado2 (2T_RD6.1)
Net2T_A1_12: 2Teclado (2T_A1.12), Externos (Pines_2Teclado.9), LED´s_Teclado2 (2T_RD5.1)
Net2T_A1_13: 2Teclado (2T_A1.13), Externos (Pines_2Teclado.7), LED´s_Teclado2 (2T_RD4.1)
Net2T_A1_14: 2Teclado (2T_A1.14), Externos (Pines_2Teclado.5), LED´s_Teclado2 (2T_RD3.1)
Net2T_A1_15: 2Teclado (2T_A1.15), Externos (Pines_2Teclado.3), LED´s_Teclado2 (2T_RD2.1)
Net2T_A1_16: 2Teclado (2T_A1.16), Externos (Pines_2Teclado.1), LED´s_Teclado2 (2T_RD1.1)
Net2T_A2_10: 2Teclado (2T_A2.10), Externos (Pines_2Teclado.27), LED´s_Teclado2 (2T_RD14.1)
Net2T_A2_11: 2Teclado (2T_A2.11), Externos (Pines_2Teclado.25), LED´s_Teclado2 (2T_RD13.1)
Net2T_A2_12: 2Teclado (2T_A2.12), Externos (Pines_2Teclado.23), LED´s_Teclado2 (2T_RD12.1)
Net2T_A2_13: 2Teclado (2T_A2.13), Externos (Pines_2Teclado.21), LED´s_Teclado2 (2T_RD11.1)
Net2T_A2_14: 2Teclado (2T_A2.14), Externos (Pines_2Teclado.19), LED´s_Teclado2 (2T_RD10.1)
Net2T_A2_15: 2Teclado (2T_A2.15), Externos (Pines_2Teclado.17), LED´s_Teclado2 (2T_RD9.1)
Net2T_A2_16: 2Teclado (2T_A2.16), Externos (Pines_2Teclado.15), LED´s_Teclado2 (2T_RD8.1)
Net2T_A3_10: 2Teclado (2T_A3.10), Externos (Pines_2Teclado.41), LED´s_Teclado2 (2T_RD21.1)
Net2T_A3_11: 2Teclado (2T_A3.11), Externos (Pines_2Teclado.39), LED´s_Teclado2 (2T_RD20.1)
Net2T_A3_12: 2Teclado (2T_A3.12), Externos (Pines_2Teclado.37), LED´s_Teclado2 (2T_RD19.1)
Net2T_A3_13: 2Teclado (2T_A3.13), Externos (Pines_2Teclado.35), LED´s_Teclado2 (2T_RD18.1)
Net2T_A3_14: 2Teclado (2T_A3.14), Externos (Pines_2Teclado.33), LED´s_Teclado2 (2T_RD17.1)
Net2T_A3_15: 2Teclado (2T_A3.15), Externos (Pines_2Teclado.31), LED´s_Teclado2 (2T_RD16.1)
Net2T_A3_16: 2Teclado (2T_A3.16), Externos (Pines_2Teclado.29), LED´s_Teclado2 (2T_RD15.1)
Net2T_A4_10: 2Teclado (2T_A4.10), Externos (Pines_2Teclado.6), LED´s_Teclado2 (2T_RD28.1)
Net2T_A4_11: 2Teclado (2T_A4.11), Externos (Pines_2Teclado.4), LED´s_Teclado2 (2T_RD27.1)
Net2T_A4_12: 2Teclado (2T_A4.12), Externos (Pines_2Teclado.2), LED´s_Teclado2 (2T_RD26.1)
Net2T_A4_13: 2Teclado (2T_A4.13), Externos (Pines_2Teclado.49), LED´s_Teclado2 (2T_RD25.1)
Net2T_A4_14: 2Teclado (2T_A4.14), Externos (Pines_2Teclado.47), LED´s_Teclado2 (2T_RD24.1)
Net2T_A4_15: 2Teclado (2T_A4.15), Externos (Pines_2Teclado.45), LED´s_Teclado2 (2T_RD23.1)
Net2T_A4_16: 2Teclado (2T_A4.16), Externos (Pines_2Teclado.43), LED´s_Teclado2 (2T_RD22.1)
Net2T_A5_10: 2Teclado (2T_A5.10), Externos (Pines_2Teclado.20), LED´s_Teclado2 (2T_RD35.1)
Net2T_A5_11: 2Teclado (2T_A5.11), Externos (Pines_2Teclado.18), LED´s_Teclado2 (2T_RD34.1)
Net2T_A5_12: 2Teclado (2T_A5.12), Externos (Pines_2Teclado.16), LED´s_Teclado2 (2T_RD33.1)
Net2T_A5_13: 2Teclado (2T_A5.13), Externos (Pines_2Teclado.14), LED´s_Teclado2 (2T_RD32.1)
Net2T_A5_14: 2Teclado (2T_A5.14), Externos (Pines_2Teclado.12), LED´s_Teclado2 (2T_RD31.1)
Net2T_A5_15: 2Teclado (2T_A5.15), Externos (Pines_2Teclado.10), LED´s_Teclado2 (2T_RD30.1)
Net2T_A5_16: 2Teclado (2T_A5.16), Externos (Pines_2Teclado.8), LED´s_Teclado2 (2T_RD29.1)
Net2T_A6_10: 2Teclado (2T_A6.10), Externos (Pines_2Teclado.34), LED´s_Teclado2 (2T_RD42.1)
Net2T_A6_11: 2Teclado (2T_A6.11), Externos (Pines_2Teclado.32), LED´s_Teclado2 (2T_RD41.1)
Net2T_A6_12: 2Teclado (2T_A6.12), Externos (Pines_2Teclado.30), LED´s_Teclado2 (2T_RD40.1)
Net2T_A6_13: 2Teclado (2T_A6.13), Externos (Pines_2Teclado.28), LED´s_Teclado2 (2T_RD39.1)
Net2T_A6_14: 2Teclado (2T_A6.14), Externos (Pines_2Teclado.26), LED´s_Teclado2 (2T_RD38.1)
Net2T_A6_15: 2Teclado (2T_A6.15), Externos (Pines_2Teclado.24), LED´s_Teclado2 (2T_RD37.1)
Net2T_A6_16: 2Teclado (2T_A6.16), Externos (Pines_2Teclado.22), LED´s_Teclado2 (2T_RD36.1)
Net2T_A7_10: 2Teclado (2T_A7.10), Externos (Pines_2Teclado.48), LED´s_Teclado2 (2T_RD49.1)
Net2T_A7_11: 2Teclado (2T_A7.11), Externos (Pines_2Teclado.46), LED´s_Teclado2 (2T_RD48.1)
Net2T_A7_12: 2Teclado (2T_A7.12), Externos (Pines_2Teclado.44), LED´s_Teclado2 (2T_RD47.1)
Net2T_A7_13: 2Teclado (2T_A7.13), Externos (Pines_2Teclado.42), LED´s_Teclado2 (2T_RD46.1)
Net2T_A7_14: 2Teclado (2T_A7.14), Externos (Pines_2Teclado.40), LED´s_Teclado2 (2T_RD45.1)
Net2T_A7_15: 2Teclado (2T_A7.15), Externos (Pines_2Teclado.38), LED´s_Teclado2 (2T_RD44.1)
Net2T_A7_16: 2Teclado (2T_A7.16), Externos (Pines_2Teclado.36), LED´s_Teclado2 (2T_RD43.1)
Net*_7: Valvulas (Val1.14), GPIO_Raspberry_b+ (*.7)
Net*_11: Pedal (Ped1.14), GPIO_Raspberry_b+ (*.11)
Net*_13: Externos (Modulo_de_Radio.22), GPIO_Raspberry_b+ (*.13)
Net*_18: Externos (Rotary.4), GPIO_Raspberry_b+ (*.18)
Net*_20: Externos (Rotary.2), GPIO_Raspberry_b+ (*.20)
Net*_22: Externos (Rotary.1), GPIO_Raspberry_b+ (*.22)
Net*_24: Externos (LCD_20x4.4), GPIO_Raspberry_b+ (*.24)
Net*_26: Externos (LCD_20x4.6), GPIO_Raspberry_b+ (*.26)
Net*_32: Externos (LCD_20x4.11), GPIO_Raspberry_b+ (*.32)
Net*_34: Externos (LCD_20x4.12), GPIO_Raspberry_b+ (*.34)
Net*_36: Externos (LCD_20x4.13), GPIO_Raspberry_b+ (*.36)
Net*_38: Externos (LCD_20x4.14), GPIO_Raspberry_b+ (*.38)
Net*_40: Externos (?.0), GPIO_Raspberry_b+ (*.40)
NetPed2_4: Pedal (Ped2.4), Externos (Pines_Sobrantes.16)
NetPed2_5: Pedal (Ped2.5), Externos (Pines_Sobrantes.18)
NetPed2_6: Pedal (Ped2.6), Externos (Pines_Sobrantes.20)
NetPed2_7: Pedal (Ped2.7), Externos (Pines_Sobrantes.22)
NetPed_A1_10: Pedal (Ped_A1.10), Externos (Pines_Pedalera.2), LED´s_Pedal (Ped_RD7.1)
NetPed_A1_11: Pedal (Ped_A1.11), Externos (Pines_Pedalera.11), LED´s_Pedal (Ped_RD6.1)
NetPed_A1_12: Pedal (Ped_A1.12), Externos (Pines_Pedalera.9), LED´s_Pedal (Ped_RD5.1)
NetPed_A1_13: Pedal (Ped_A1.13), Externos (Pines_Pedalera.7), LED´s_Pedal (Ped_RD4.1)
NetPed_A1_14: Pedal (Ped_A1.14), Externos (Pines_Pedalera.5), LED´s_Pedal (Ped_RD3.1)
NetPed_A1_15: Pedal (Ped_A1.15), Externos (Pines_Pedalera.3), LED´s_Pedal (Ped_RD2.1)
NetPed_A1_16: Pedal (Ped_A1.16), Externos (Pines_Pedalera.1), LED´s_Pedal (Ped_RD1.1)
NetPed_A2_12: Pedal (Ped_A2.12), Externos (Pines_Pedalera.12), LED´s_Pedal (Ped_RD12.1)
NetPed_A2_13: Pedal (Ped_A2.13), Externos (Pines_Pedalera.10), LED´s_Pedal (Ped_RD11.1)
NetPed_A2_14: Pedal (Ped_A2.14), Externos (Pines_Pedalera.8), LED´s_Pedal (Ped_RD10.1)
NetPed_A2_15: Pedal (Ped_A2.15), Externos (Pines_Pedalera.6), LED´s_Pedal (Ped_RD9.1)
NetPed_A2_16: Pedal (Ped_A2.16), Externos (Pines_Pedalera.4), LED´s_Pedal (Ped_RD8.1)
NetPines_Sobrantes_2: Valvulas (Val4.1), Externos (Pines_Sobrantes.2)
NetPines_Sobrantes_4: Valvulas (Val4.2), Externos (Pines_Sobrantes.4)
NetPines_Sobrantes_6: Valvulas (Val4.3), Externos (Pines_Sobrantes.6)
NetPines_Sobrantes_8: Valvulas (Val4.4), Externos (Pines_Sobrantes.8)
NetPines_Sobrantes_10: Valvulas (Val4.5), Externos (Pines_Sobrantes.10)
NetPines_Sobrantes_12: Valvulas (Val4.6), Externos (Pines_Sobrantes.12)
NetPines_Sobrantes_14: Valvulas (Val4.7), Externos (Pines_Sobrantes.14)
NetPines_Valvulas_1: Valvulas (Val_A1.16), Externos (Pines_Valvulas.1), LED´s_Valvulas (Val_RD1.1)
NetPines_Valvulas_2: Valvulas (Val_A2.10), Externos (Pines_Valvulas.2), LED´s_Valvulas (Val_RD14.1)
NetPines_Valvulas_3: Valvulas (Val_A1.15), Externos (Pines_Valvulas.3), LED´s_Valvulas (Val_RD2.1)
NetPines_Valvulas_4: Valvulas (Val_A3.16), Externos (Pines_Valvulas.4), LED´s_Valvulas (Val_RD15.1)
NetPines_Valvulas_5: Valvulas (Val_A1.14), Externos (Pines_Valvulas.5), LED´s_Valvulas (Val_RD3.1)
NetPines_Valvulas_6: Valvulas (Val_A3.15), Externos (Pines_Valvulas.6), LED´s_Valvulas (Val_RD16.1)
NetPines_Valvulas_7: Valvulas (Val_A1.13), Externos (Pines_Valvulas.7), LED´s_Valvulas (Val_RD4.1)
NetPines_Valvulas_8: Valvulas (Val_A3.14), Externos (Pines_Valvulas.8), LED´s_Valvulas (Val_RD17.1)
NetPines_Valvulas_9: Valvulas (Val_A1.12), Externos (Pines_Valvulas.9), LED´s_Valvulas (Val_RD5.1)
NetPines_Valvulas_10: Valvulas (Val_A3.13), Externos (Pines_Valvulas.10), LED´s_Valvulas (Val_RD18.1)
NetPines_Valvulas_11: Valvulas (Val_A1.11), Externos (Pines_Valvulas.11), LED´s_Valvulas (Val_RD6.1)
NetPines_Valvulas_12: Valvulas (Val_A3.12), Externos (Pines_Valvulas.12), LED´s_Valvulas (Val_RD19.1)
NetPines_Valvulas_13: Valvulas (Val_A1.10), Externos (Pines_Valvulas.13), LED´s_Valvulas (Val_RD7.1)
NetPines_Valvulas_14: Valvulas (Val_A3.11), Externos (Pines_Valvulas.14), LED´s_Valvulas (Val_RD20.1)
NetPines_Valvulas_15: Valvulas (Val_A2.16), Externos (Pines_Valvulas.15), LED´s_Valvulas (Val_RD8.1)
NetPines_Valvulas_16: Valvulas (Val_A3.10), Externos (Pines_Valvulas.16), LED´s_Valvulas (Val_RD21.1)
NetPines_Valvulas_17: Valvulas (Val_A2.15), Externos (Pines_Valvulas.17), LED´s_Valvulas (Val_RD9.1)
NetPines_Valvulas_18: Valvulas (Val_A4.16), Externos (Pines_Valvulas.18), LED´s_Valvulas (Val_RD22.1)
NetPines_Valvulas_19: Valvulas (Val_A2.14), Externos (Pines_Valvulas.19), LED´s_Valvulas (Val_RD10.1)
NetPines_Valvulas_20: Valvulas (Val_A4.15), Externos (Pines_Valvulas.20), LED´s_Valvulas (Val_RD23.1)
NetPines_Valvulas_21: Valvulas (Val_A2.13), Externos (Pines_Valvulas.21), LED´s_Valvulas (Val_RD11.1)
NetPines_Valvulas_22: Valvulas (Val_A4.14), Externos (Pines_Valvulas.22), LED´s_Valvulas (Val_RD24.1)
NetPines_Valvulas_23: Valvulas (Val_A2.12), Externos (Pines_Valvulas.23), LED´s_Valvulas (Val_RD12.1)
NetPines_Valvulas_24: Valvulas (Val_A4.13), Externos (Pines_Valvulas.24), LED´s_Valvulas (Val_RD25.1)
NetPines_Valvulas_25: Valvulas (Val_A2.11), Externos (Pines_Valvulas.25), LED´s_Valvulas (Val_RD13.1)